# EAGLE schematic projeto1 (EAGLE 9.6.2)
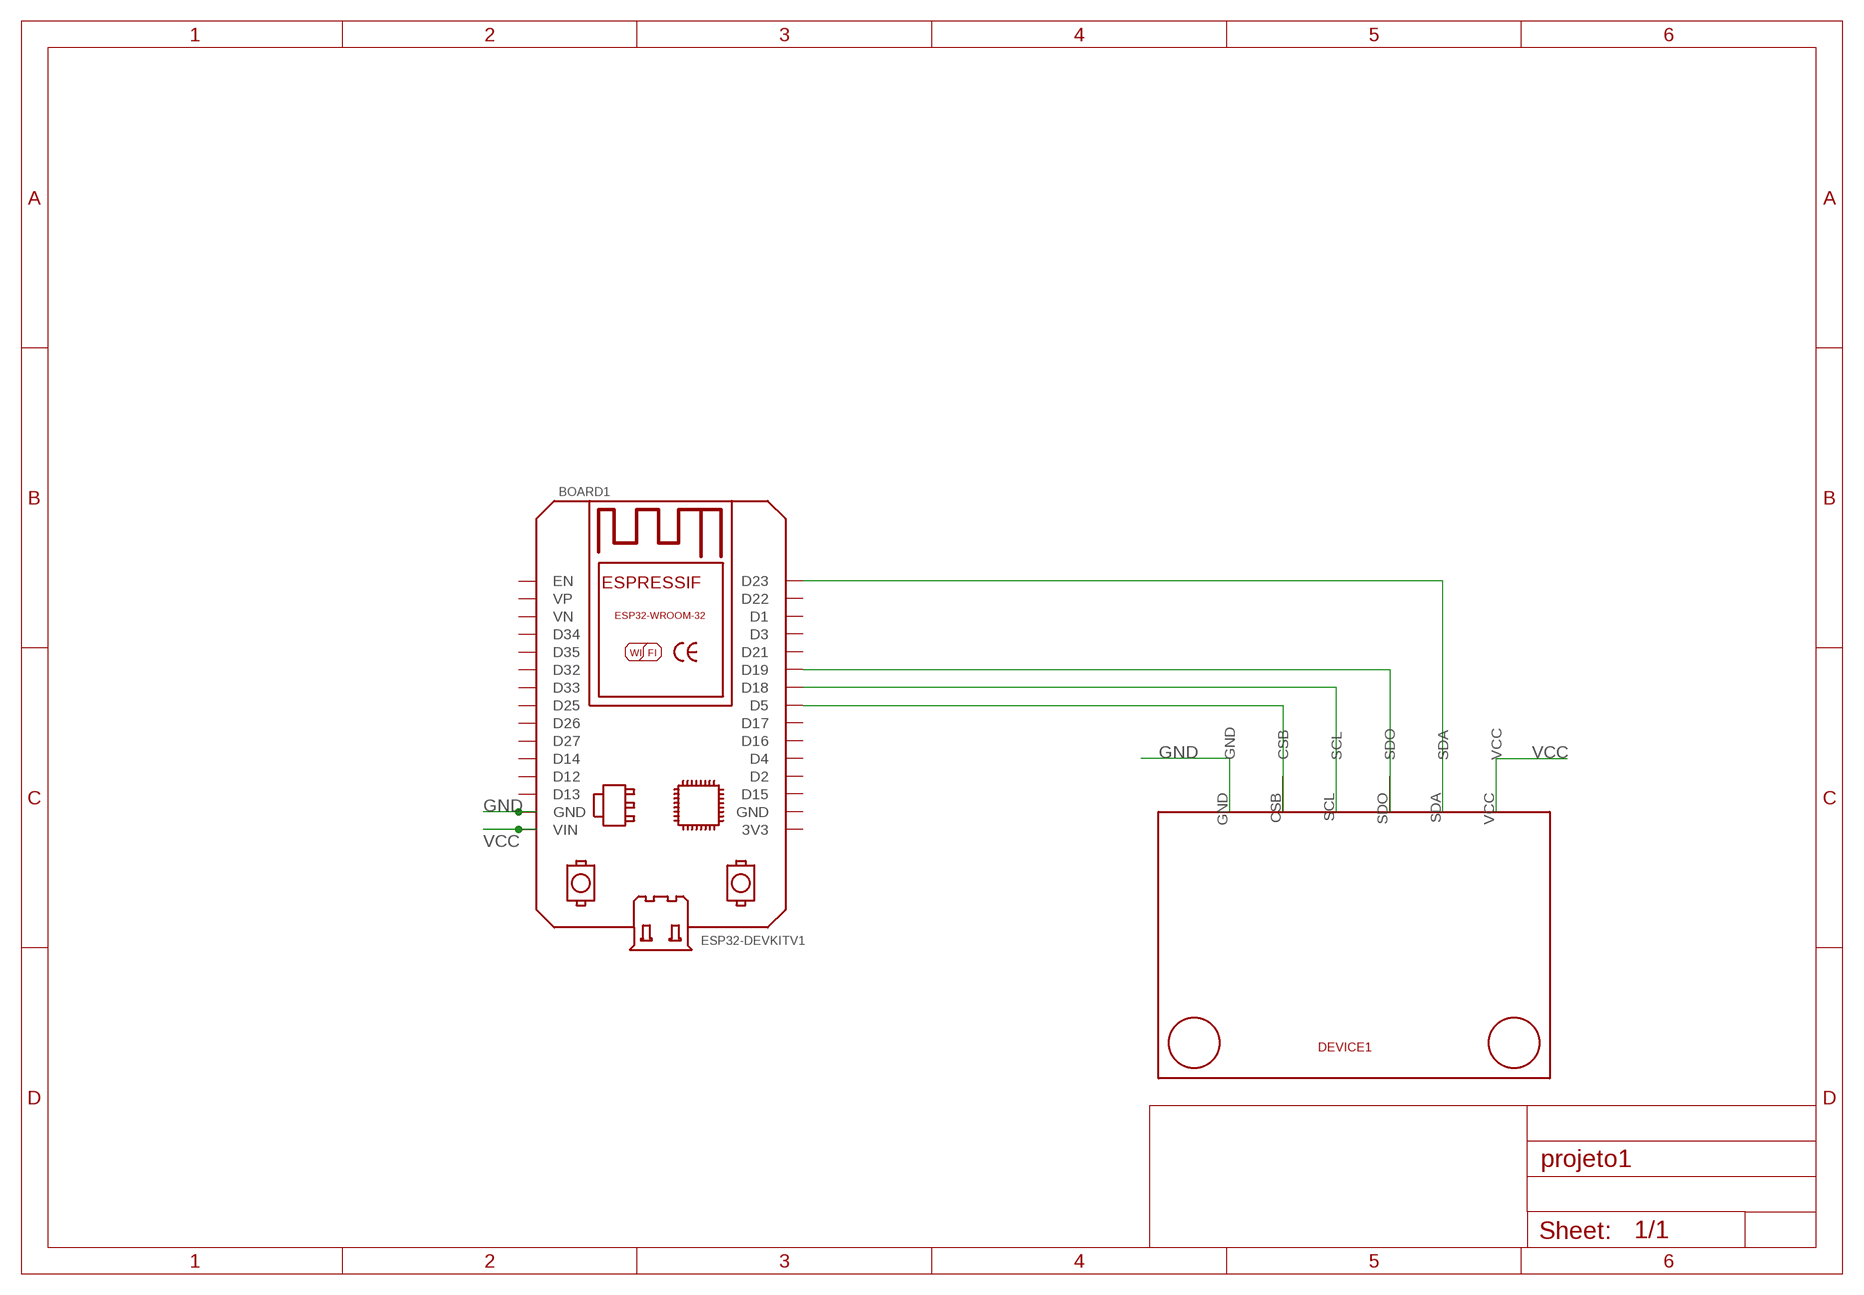
[diagram p0: schematic, sheet 1]

## Parts
BOARD1  ESP32DEVKITV1  [ESP32-DEVKITV1]
U$2  DEVICE1  [DEVICE_FOOTPRINT]

## Nets
GND: BOARD1.GND U$2.GND
N$1: BOARD1.D23 U$2.SDA
N$2: BOARD1.D5 U$2.CSB
N$3: BOARD1.D19 U$2.SDO
N$5: BOARD1.D18 U$2.SCL
VCC: BOARD1.VIN U$2.VCC
Unconnected: BOARD1.3V3 BOARD1.D1 BOARD1.D2 BOARD1.D3 BOARD1.D4 BOARD1.D12 BOARD1.D13 BOARD1.D14 BOARD1.D15 BOARD1.D16 BOARD1.D17 BOARD1.D21 BOARD1.D22 BOARD1.D25 BOARD1.D26 BOARD1.D27 BOARD1.D32 BOARD1.D33 BOARD1.D34 BOARD1.D35 BOARD1.EN BOARD1.GND@1(GND) BOARD1.VN BOARD1.VP

## Library data of the parts
BOARD1 = ESP32-DEVKITV1:ESP32DEVKITV1: https://github.com/shridattdudhat
U$2 = Cactus_Library:DEVICE1